# EAGLE design sc (EAGLE 9.2.2)
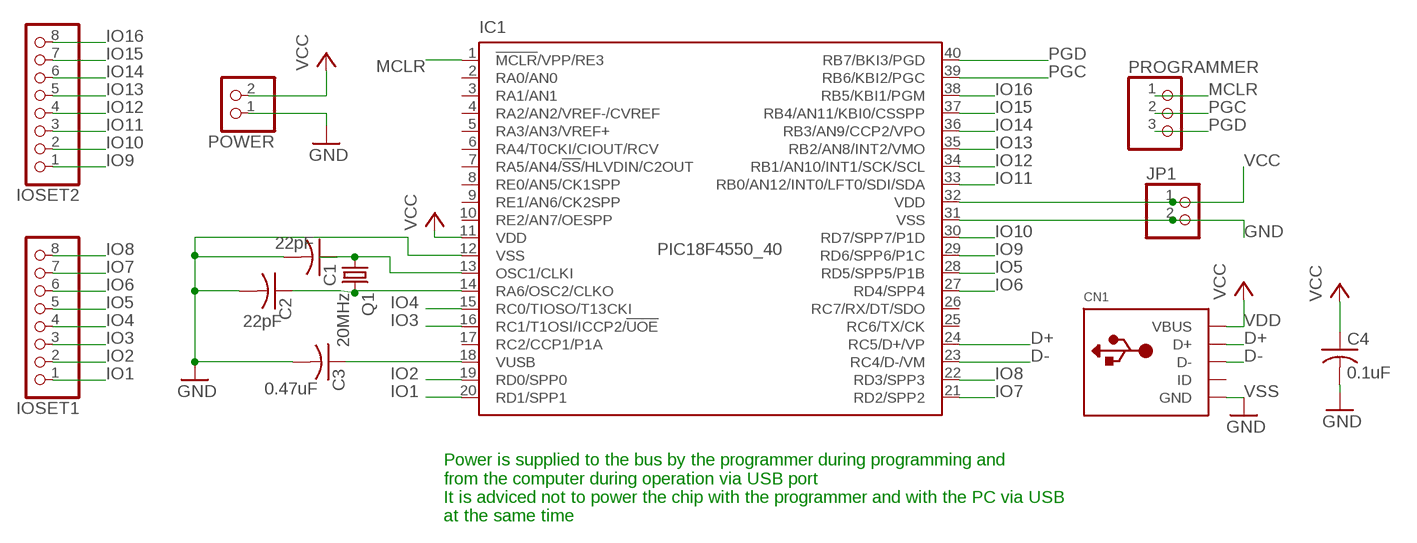
[diagram p0: schematic, sheet 1]

## Parts
C1  22pF  C-US025-024X044  [C025-024X044]
C2  22pF  C-US025-024X044  [C025-024X044]
C3  0.47uF  C-US025-024X044  [C025-024X044]
C4  0.1uF  C-US025-024X044  [C025-024X044]
CN1  USBTHM  [USB-MINIB-THM]
IC1  PIC18F4550_40  [DIL40]
IOSET1  PINHD-1X8  [1X08]
IOSET2  PINHD-1X8  [1X08]
JP1  PINHD-1X2  [1X02]
POWER  PINHD-1X2  [1X02]
PROGRAMMER  PINHD-1X3  [1X03]
Q1  20MHz  CRYSTALHC18U-V  [HC18U-V]

## Nets
D+: CN1.D+ IC1.24(RC5/D+/VP)
D-: CN1.D- IC1.23(RC4/D-/VM)
GND: C1.2 C2.2 C3.2 C4.2 IC1.12(VSS) IC1.31(VSS) JP1.2 POWER.1
IO1: IC1.20(RD1/SPP1) IOSET1.1
IO2: IC1.19(RD0/SPP0) IOSET1.2
IO3: IC1.16(RC1/T1OSI/ICCP2/!UOE) IOSET1.3
IO4: IC1.15(RC0/TIOSO/T13CKI) IOSET1.4
IO5: IC1.28(RD5/SPP5/P1B) IOSET1.5
IO6: IC1.27(RD4/SPP4) IOSET1.6
IO7: IC1.21(RD2/SPP2) IOSET1.7
IO8: IC1.22(RD3/SPP3) IOSET1.8
IO9: IC1.29(RD6/SPP6/P1C) IOSET2.1
IO10: IC1.30(RD7/SPP7/P1D) IOSET2.2
IO11: IC1.33(RB0/AN12/INT0/LFT0/SDI/SDA) IOSET2.3
IO12: IC1.34(RB1/AN10/INT1/SCK/SCL) IOSET2.4
IO13: IC1.35(RB2/AN8/INT2/VMO) IOSET2.5
IO14: IC1.36(RB3/AN9/CCP2/VPO) IOSET2.6
IO15: IC1.37(RB4/AN11/KBI0/CSSPP) IOSET2.7
IO16: IC1.38(RB5/KBI1/PGM) IOSET2.8
MCLR: IC1.1(!MCLR!/VPP/RE3) PROGRAMMER.1
N$1: C1.1 IC1.13(OSC1/CLKI) Q1.1
N$2: C2.1 IC1.14(RA6/OSC2/CLKO) Q1.2
N$3: C3.1 IC1.18(VUSB)
PGC: IC1.39(RB6/KBI2/PGC) PROGRAMMER.2
PGD: IC1.40(RB7/BKI3/PGD) PROGRAMMER.3
VCC: C4.1 IC1.11(VDD) IC1.32(VDD) JP1.1 POWER.2
VDD: CN1.VBUS ; supply symbol labelled VCC
VSS: CN1.GND ; supply symbol labelled GND
Unconnected: CN1.ID IC1.2(RA0/AN0) IC1.3(RA1/AN1) IC1.4(RA2/AN2/VREF-/CVREF) IC1.5(RA3/AN3/VREF+) IC1.6(RA4/T0CKI/CIOUT/RCV) IC1.7(RA5/AN4/!SS!/HLVDIN/C2OUT) IC1.8(RE0/AN5/CK1SPP) IC1.9(RE1/AN6/CK2SPP) IC1.10(RE2/AN7/OESPP) IC1.17(RC2/CCP1/P1A) IC1.25(RC6/TX/CK) IC1.26(RC7/RX/DT/SDO)

## Notes on the sheet
- Power is supplied to the bus by the programmer during programming and 
  from the computer during operation via USB port
  It is adviced not to power the chip with the programmer and with the PC via USB
  at the same time

## Library data of the parts
C1-C4 = adafruit:C-US: CAPACITOR, American symbol
CN1 = adafruit:USB: USB Connectors USBMINIB - Surface Mount Female Mini-B USB Connector 4UConnector: 06564 By microbuilder.eu Thru-hole RA Female Mini-B USB Connector 4UConnector: 18732 By ladyada.net
IC1 = microchip:PIC18F4*_40: USB Microcontrollers with nanoWatt Technology High-Performance, Enhanced Flash, 28/40/44-Pin, Source: http://ww1.microchip.com/downloads/en/devicedoc/39632c.pdf; MF: MICROCHIP; MPN: PIC18F4550-I/P; OC_FARNELL: 9321357; OC_NEWARK: 74K8623
IOSET1 IOSET2 = pinhead:PINHD-1X8: PIN HEADER
JP1 POWER = pinhead:PINHD-1X2: PIN HEADER
PROGRAMMER = pinhead@1:PINHD-1X3: PIN HEADER
Q1 = adafruit:CRYSTAL: CRYSTAL; OC_FARNELL: unknown; OC_NEWARK: unknown

## Board
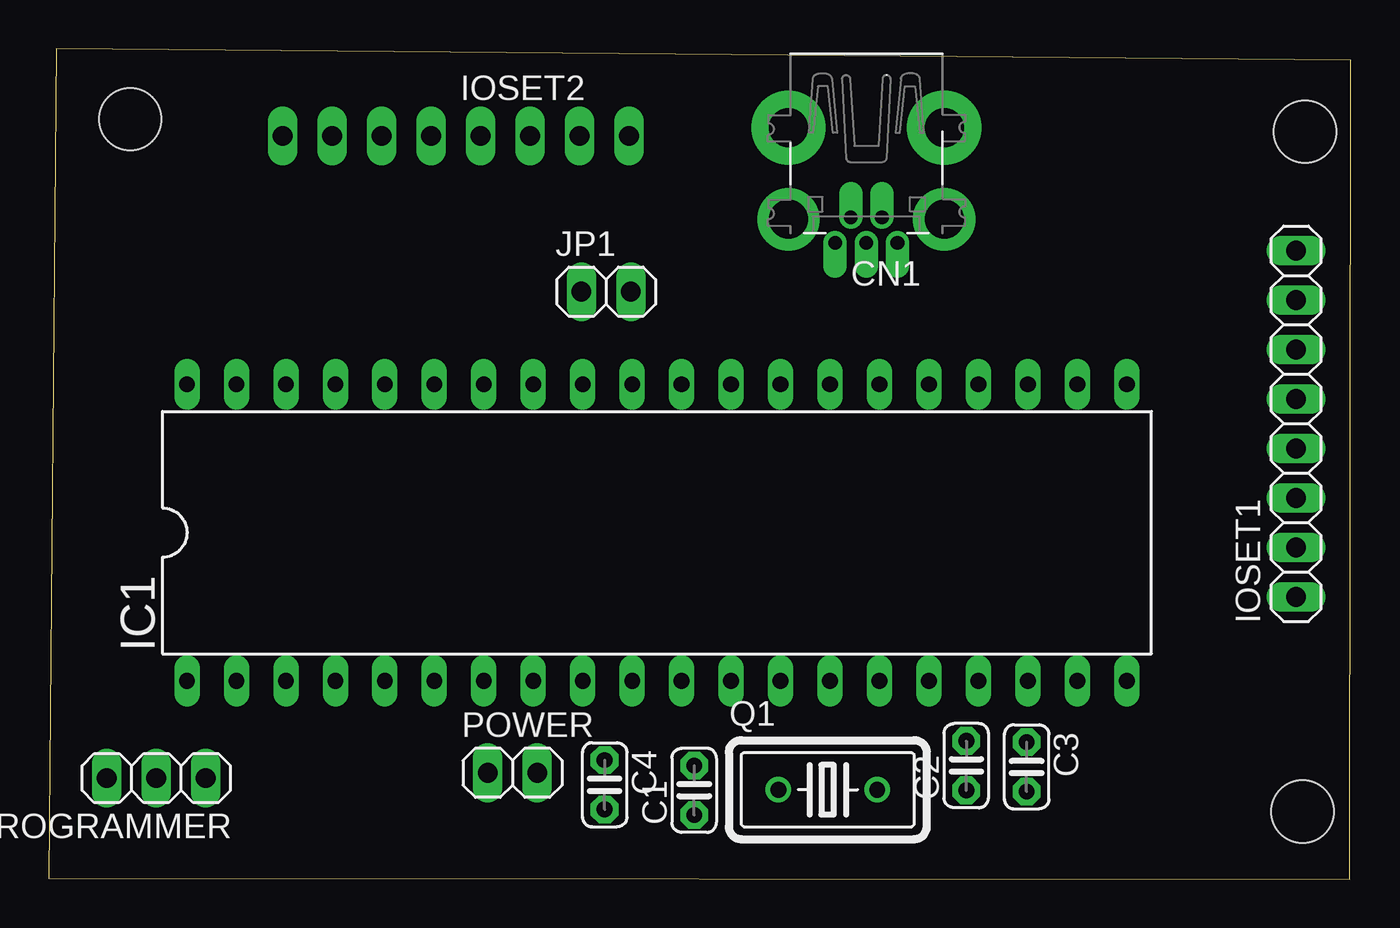
[diagram p1: board, top side]
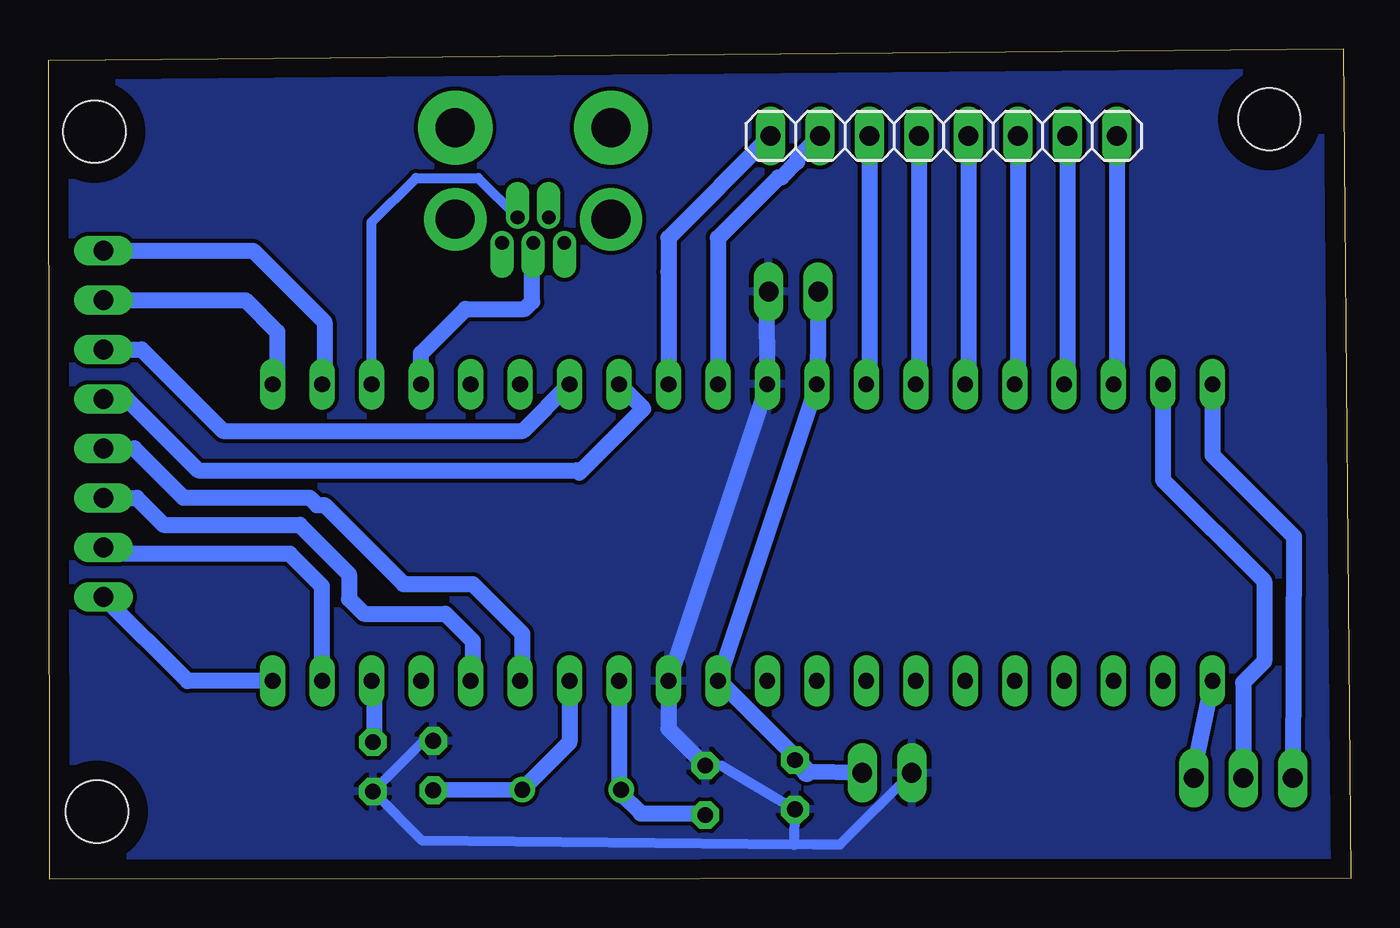
[diagram p2: board, bottom side, seen from below]

Size 66.86 x 42.65 mm. Coordinates in mm from the lower left corner, seen from the top.
Outline: 0,0.03 66.8,0 66.86,42.06 0.38,42.65 0,0.03
Copper layers (1*16): Top 0.035mm / dielectric 1.5mm / Bottom 0.035mm
Design rules "default": minimum track width 10mil, minimum drill 24mil, track to track 8mil, track to pad 8mil, pad to pad 8mil, via to via 8mil, smd to smd 8mil, copper to edge 40mil, drill to drill 8mil, minimum pad ring 10mil, minimum via ring 8mil, stop-mask expansion 4mil, vias tented up to drill 0mil, thermal gap 10mil
Holes 3.2 mm at 64.39,3.46 64.52,38.39 4.19,39.02

### Footprints (pad centres in the part's own frame; a part is rotated, then mirrored left to right if it is on the bottom)
C025-024X044 = drill 0.813 pad 1.422 octagon: 1 -1.27,0; 2 1.27,0
USB-MINIB-THM = drill 0.7 offset: D+ 0,9.8; D- -0.8,8.5; GND 1.6,9.8; ID 0.8,8.5; VBUS -1.6,9.8 | drill 2 pad 3.81: GND1 -4,3.9; GND4 4,3.9 | drill 2 pad 3.2: GND2 -4,8.6; GND3 4,8.6
DIL40 = drill 0.813 long: 1 -24.13,-7.62; 2 -21.59,-7.62; 3 -19.05,-7.62; 4 -16.51,-7.62; 5 -13.97,-7.62; 6 -11.43,-7.62; 7 -8.89,-7.62; 8 -6.35,-7.62; 9 -3.81,-7.62; 10 -1.27,-7.62; 11 1.27,-7.62; 12 3.81,-7.62; 13 6.35,-7.62; 14 8.89,-7.62; 15 11.43,-7.62; 16 13.97,-7.62; 17 16.51,-7.62; 18 19.05,-7.62; 19 21.59,-7.62; 20 24.13,-7.62; 21 24.13,7.62; 22 21.59,7.62; 23 19.05,7.62; 24 16.51,7.62; 25 13.97,7.62; 26 11.43,7.62; 27 8.89,7.62; 28 6.35,7.62; 29 3.81,7.62; 30 1.27,7.62; 31 -1.27,7.62; 32 -3.81,7.62; 33 -6.35,7.62; 34 -8.89,7.62; 35 -11.43,7.62; 36 -13.97,7.62; 37 -16.51,7.62; 38 -19.05,7.62; 39 -21.59,7.62; 40 -24.13,7.62
1X08 = drill 1.016 long: 1 -8.89,0; 2 -6.35,0; 3 -3.81,0; 4 -1.27,0; 5 1.27,0; 6 3.81,0; 7 6.35,0; 8 8.89,0
1X02 = drill 1.016 long: 1 -1.27,0; 2 1.27,0
1X03 = drill 1.016 long: 1 -2.54,0; 2 0,0; 3 2.54,0
HC18U-V = drill 0.813: 1 -2.54,0; 2 2.54,0

### Placement (x,y rotation side)
C1  33.15,4.56 90 top
C2  47.12,5.83 90 top
C3  50.21,5.77 270 top
C4  28.55,4.84 270 top
CN1  41.98,42.48 180 top
IC1  31.23,17.79 0 top
IOSET1  64.05,23.39 90 top
IOSET2  20.91,38.17 0 bottom
JP1  28.62,30.16 0 top
POWER  23.82,5.46 0 top
PROGRAMMER  5.52,5.19 180 top
Q1  40,4.59 0 top

### Tracks (layer width: path | path; a pad name or v marks a point on that pad's centre or on a via)
D+
  Bottom 0.813: IC1.24 47.74,27 45.47,29.28 42.42,29.28 42.04,29.66 42.04,32.63 CN1.D+
D-
  Bottom 0.508: IC1.23 50.28,33.73 48.01,36.01 44.81,36.01 CN1.D-
GND
  Bottom 0.508: C2.2 47.61,7.1 C3.2 47.68,1.97 28.58,1.76 | C1.2 32.3,5.83 C4.2 28.58,1.76 | 28.58,1.76 27.55,1.77 26.23,1.77 POWER.1
  Bottom 0.813: C1.2 35.04,7.72 IC1.12 IC1.31 30.03,30.03 JP1.2
  pour Bottom: -1.43,56.57 -1.35,-1.24 75.67,-1.24 74.92,56.57
IO1
  Bottom 0.813: IC1.20 59.73,10.17 IOSET1.1
IO2
  Bottom 0.813: IC1.19 52.82,15.04 54.48,16.7 63.72,16.7 IOSET1.2
IO3
  Bottom 0.813: IC1.16 45.09,10.29 45.09,12.22 46.48,13.62 50.67,13.62 51.43,14.38 51.43,15.65 53.98,18.19 60.96,18.19 62.34,19.58 IOSET1.3
IO4
  Bottom 0.813: IC1.15 42.54,10.29 42.54,12.61 45.09,15.15 48.64,15.15 52.7,19.21 53.09,19.21 53.47,19.59 59.94,19.59 62.47,22.12 IOSET1.4
IO5
  Bottom 0.813: IOSET1.5 62.85,24.66 59.18,20.99 39.75,20.99 39.62,20.86 36.33,24.16 IC1.28
IO6
  Bottom 0.813: IOSET1.6 62.09,27.2 57.91,23.02 42.52,23.02 IC1.27
IO7
  Bottom 0.813: IOSET1.7 56.75,29.74 55.12,28.1 55.12,25.66 IC1.21
IO8
  Bottom 0.813: IOSET1.8 56.37,32.28 52.7,28.61 52.7,25.53 IC1.22
IO9
  Bottom 0.813: IC1.29 35.04,31.18 35.04,32.93 IOSET2.1
IO10
  Bottom 0.813: IC1.30 32.5,32.93 29.39,36.04 29.23,36.04 28.43,36.84 28.43,37 IOSET2.2
IO11
  Bottom 0.813: IOSET2.3 24.72,25.58 IC1.33
IO12
  Bottom 0.813: IOSET2.4 22.18,25.58 IC1.34
IO13
  Bottom 0.813: IOSET2.5 19.64,25.58 IC1.35
IO14
  Bottom 0.813: IOSET2.6 17.1,25.58 IC1.36
IO15
  Bottom 0.813: IOSET2.7 14.56,25.58 IC1.37
IO16
  Bottom 0.813: IOSET2.8 12.02,25.58 IC1.38
MCLR
  Bottom 0.813: IC1.1 8.13,5.25
  Bottom 1.016: 8.13,5.25 PROGRAMMER.1
N$1
  Bottom 0.813: IC1.13 37.58,4.71 Q1.1 | 37.46,4.38 36.45,3.37 33.23,3.37
  Bottom 1.016: Q1.1 37.46,4.38 | 33.23,3.37 C1.1
N$2
  Bottom 0.813: IC1.14 40.12,7.01 Q1.2 C2.1
N$3
  Bottom 0.813: IC1.18 50.16,10.05 50.16,7.09 C3.1
PGC
  Bottom 0.813: IC1.39 9.64,20.5 4.45,15.31 4.45,11.18 5.52,10.1 PROGRAMMER.2
PGD
  Bottom 0.813: IC1.40 7.1,21.77 3.17,17.85 2.92,17.59 PROGRAMMER.3
VCC
  Bottom 0.813: JP1.1 27.35,26.9 IC1.32 IC1.11 32.42,10.17 28.55,6.3 C4.1 | POWER.2 27.93,5.5
  Bottom 1.016: 27.93,5.5 C4.1